# Altium schematic sheet PIC32MZ_cam_sch.SchDoc
size A3
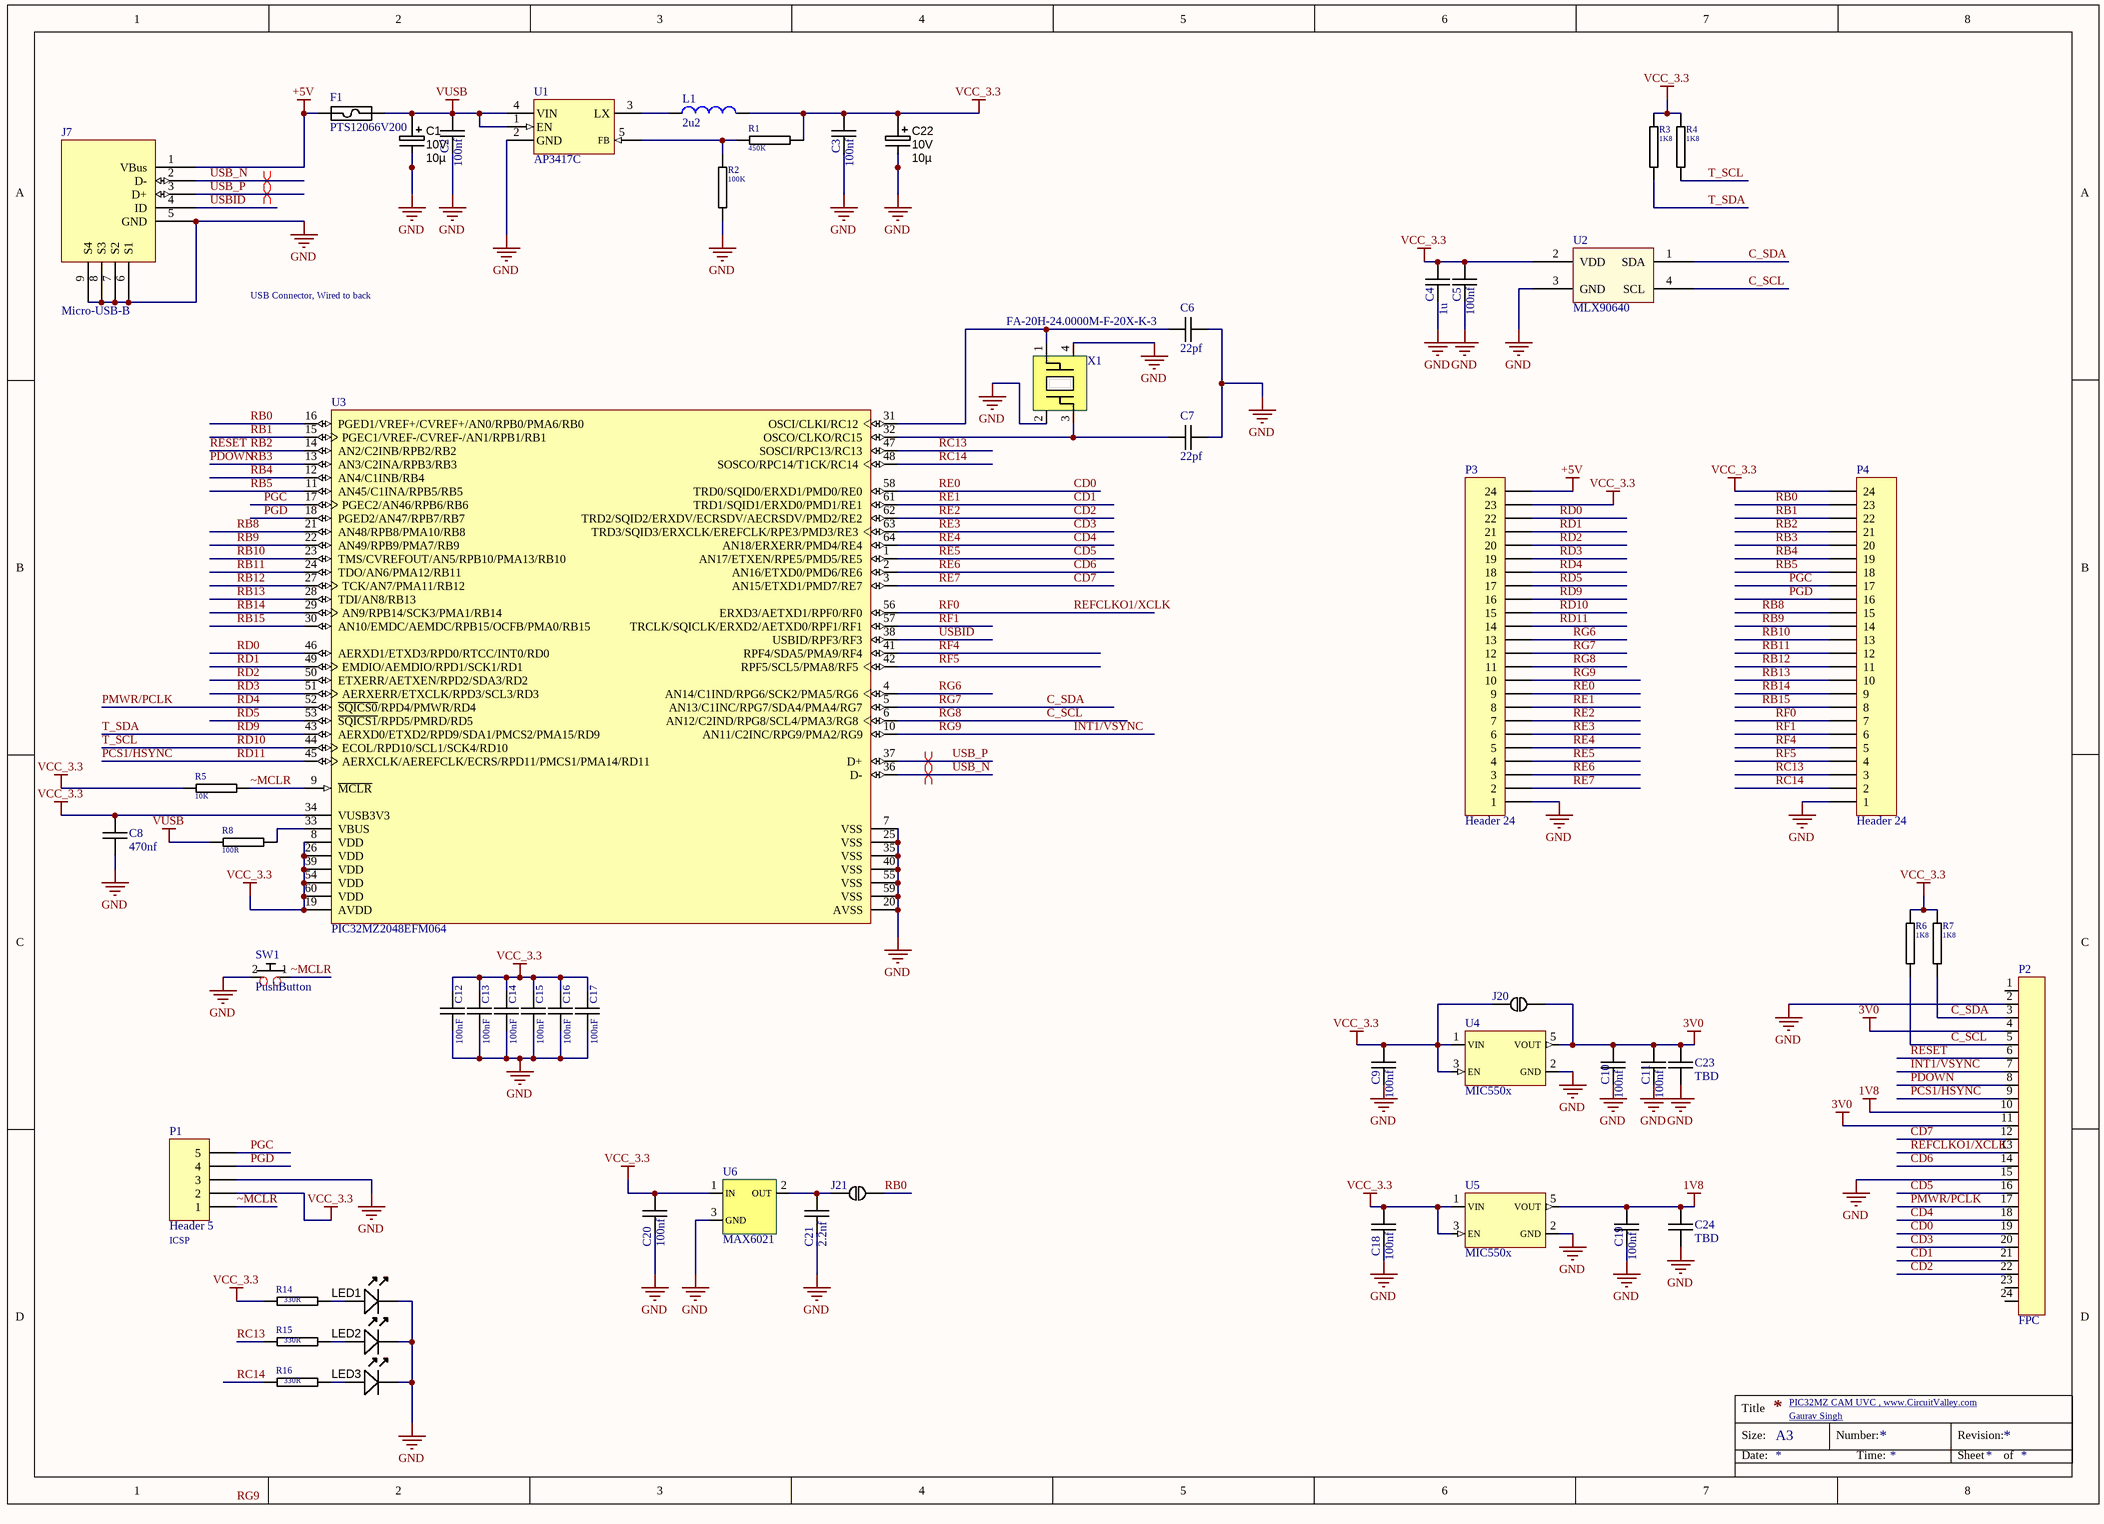
[diagram p0: PIC32MZ_cam_sch.SchDoc]

## Parts
C1  Ratings: 10V  [CAPMP3528X210N]  (hidden comment: 10µ)
C2  100nf  [0603C-GENERIC]
C3  100nf  [0603C-GENERIC]
C4  1u  [0603C-GENERIC]
C5  100nf  [0603C-GENERIC]
C6  22pf  [0603C-GENERIC]
C7  22pf  [0603C-GENERIC]
C8  470nf  [0603C-GENERIC]
C9  100nf  [0603C-GENERIC]
C10  100nf  [0603C-GENERIC]
C11  100nf  [0603C-GENERIC]
C12  100nF  [0603C-GENERIC]
C13  100nF  [0603C-GENERIC]
C14  100nF  [0603C-GENERIC]
C15  100nF  [0603C-GENERIC]
C16  100nF  [0603C-GENERIC]
C17  100nF  [0603C-GENERIC]
C18  100nf  [0603C-GENERIC]
C19  100nf  [0603C-GENERIC]
C20  100nf  [0603C-GENERIC]
C21  2.2nf  [0603C-GENERIC]
C22  Ratings: 10V  [CAPMP3528X210N]  (hidden comment: 10µ)
C23  TBD  [0805C-TBD]
C24  TBD  [0805C-TBD]
F1  PTS12066V200  [RESC3216N]
J7  Micro-USB-B  [10118193-0001lfc]
J20  BYPASS-MINI  [BYPASS-MINI]  (value not drawn)
J21  BYPASS-MINI  [BYPASS-MINI]  (value not drawn)
L1  2u2  [TAIYO_NRS4018T2R2MDGJ]
LED1  Blue  [LED-0805-K]  (value not drawn)
LED2  Blue  [LED-0805-K]  (value not drawn)
LED3  Blue  [LED-0805-K]  (value not drawn)
P1  Header 5  [HDR1X5]
P2  FPC  [OV7xxx Cam]
P3  Header 24  [HDR1X24]
P4  Header 24  [HDR1X24]
R1  450K  [0603R-10K]
R2  100K  [0603R-10K]
R3  1K8  [0603R-10K]
R4  1K8  [0603R-10K]
R5  10K  [0603R-10K]
R6  1K8  [0603R-10K]
R7  1K8  [0603R-10K]
R8  100R  [0603R-10K]
R14  330R  [0603R-10K]
R15  330R  [0603R-10K]
R16  330R  [0603R-10K]
SW1  PushButton  [PushButtonGrid5.08x3.81]
U1  AP3417C  [SOT23-5]
U2  MLX90640  [MLX90640]
U3  PIC32MZ2048EFM064  [MCHP-QFP-PT64_V]
U4  MIC550x  [SOT23-5]
U5  MIC550x  [SOT23-5]
U6  MAX6021  [SOT23-3]
X1  FA-20H-24.0000M-F-20X-K-3  [Active Oscillator 2520]

## Nets
1V8: C19.2 C24.1 P2.10 U5.5(VOUT)
3V0: C10.2 C11.2 C23.1 J20.1 P2.4 P2.11 U4.5(VOUT)
+5V: F1.1 J7.1(VBus) P3.24
GND: C1.2 C2.1 C3.1 C4.1 C5.1 C6.1 C7.1 C8.2 C9.1 C10.1 C11.1 C12.1 C13.1 C14.1 C15.1 C16.1 C17.1 C18.1 C19.1 C20.1 C21.1 C22.2 C23.2 C24.2 J7.5(GND) J7.6(S1) J7.7(S2) J7.8(S3) J7.9(S4) LED1.K LED2.K LED3.K P1.3 P2.2 P2.15 P3.1 P4.1 R2.1 SW1.2(P2) U1.2(GND) U2.3(GND) U3.7(VSS) U3.20(AVSS) U3.25(VSS) U3.35(VSS) U3.40(VSS) U3.55(VSS) U3.59(VSS) U4.2(GND) U5.2(GND) U6.3(GND) X1.2 X1.4
VCC_3.3: C3.2 C4.2 C5.2 C8.1 C9.2 C12.2 C13.2 C14.2 C15.2 C16.2 C17.2 C18.2 C20.2 C22.1 J20.2 L1.2 P1.2 P3.23 P4.24 R1.2 R3.2 R4.2 R5.1 R6.2 R7.2 R14.1 U2.2(VDD) U3.8(VDD) U3.19(AVDD) U3.26(VDD) U3.34(VUSB3V3) U3.39(VDD) U3.54(VDD) U3.60(VDD) U4.1(VIN) U4.3(EN) U5.1(VIN) U5.3(EN) U6.1(IN)
VUSB: C1.1 C2.2 F1.2 R8.1 U1.1(EN) U1.4(VIN)
C_SCL: P2.5 P3.11 R6.1 U2.4(SCL) U3.6(AN12/C2IND/RPG8/SCL4/PMA3/RG8)  [also labelled RG8]
C_SDA: P2.3 P3.12 R7.1 U2.1(SDA) U3.5(AN13/C1INC/RPG7/SDA4/PMA4/RG7)  [also labelled RG7]
CD0: P2.19 P3.9 U3.58(TRD0/SQID0/ERXD1/PMD0/RE0)  [also labelled RE0]
CD1: P2.21 P3.8 U3.61(TRD1/SQID1/ERXD0/PMD1/RE1)  [also labelled RE1]
CD2: P2.22 P3.7 U3.62(TRD2/SQID2/ERXDV/ECRSDV/AECRSDV/PMD2/RE2)  [also labelled RE2]
CD3: P2.20 P3.6 U3.63(TRD3/SQID3/ERXCLK/EREFCLK/RPE3/PMD3/RE3)  [also labelled RE3]
CD4: P2.18 P3.5 U3.64(AN18/ERXERR/PMD4/RE4)  [also labelled RE4]
CD5: P2.16 P3.4 U3.1(AN17/ETXEN/RPE5/PMD5/RE5)  [also labelled RE5]
CD6: P2.14 P3.3 U3.2(AN16/ETXD0/PMD6/RE6)  [also labelled RE6]
CD7: P2.12 P3.2 U3.3(AN15/ETXD1/PMD7/RE7)  [also labelled RE7]
INT1/VSYNC: P2.7 P3.10 U3.10(AN11/C2INC/RPG9/PMA2/RG9)  [also labelled RG9]
PCS1/HSYNC: P2.9 P3.14 U3.45(AERXCLK/AEREFCLK/ECRS/RPD11/PMCS1/PMA14/RD11)  [also labelled RD11]
PDOWN: P2.8 P4.20 U3.13(AN3/C2INA/RPB3/RB3)  [also labelled RB3]
PGC: P1.5 P4.17 U3.17(PGEC2/AN46/RPB6/RB6)
PGD: P1.4 P4.16 U3.18(PGED2/AN47/RPB7/RB7)
PMWR/PCLK: P2.17 P3.18 U3.52(~{SQICS0}/RPD4/PMWR/RD4)  [also labelled RD4]
RB0: J21.1 P4.23 U3.16(PGED1/VREF+/CVREF+/AN0/RPB0/PMA6/RB0)
RB1: P4.22 U3.15(PGEC1/VREF-/CVREF-/AN1/RPB1/RB1)
RB2: P2.6 P4.21 U3.14(AN2/C2INB/RPB2/RB2)  [also labelled RESET]
RB4: P4.19 U3.12(AN4/C1INB/RB4)
RB5: P4.18 U3.11(AN45/C1INA/RPB5/RB5)
RB8: P4.15 U3.21(AN48/RPB8/PMA10/RB8)
RB9: P4.14 U3.22(AN49/RPB9/PMA7/RB9)
RB10: P4.13 U3.23(TMS/CVREFOUT/AN5/RPB10/PMA13/RB10)
RB11: P4.12 U3.24(TDO/AN6/PMA12/RB11)
RB12: P4.11 U3.27(TCK/AN7/PMA11/RB12)
RB13: P4.10 U3.28(TDI/AN8/RB13)
RB14: P4.9 U3.29(AN9/RPB14/SCK3/PMA1/RB14)
RB15: P4.8 U3.30(AN10/EMDC/AEMDC/RPB15/OCFB/PMA0/RB15)
RC13: P4.3 R15.1 U3.47(SOSCI/RPC13/RC13)
RC14: P4.2 R16.1 U3.48(SOSCO/RPC14/T1CK/RC14)
RD0: P3.22 U3.46(AERXD1/ETXD3/RPD0/RTCC/INT0/RD0)
RD1: P3.21 U3.49(EMDIO/AEMDIO/RPD1/SCK1/RD1)
RD2: P3.20 U3.50(ETXERR/AETXEN/RPD2/SDA3/RD2)
RD3: P3.19 U3.51(AERXERR/ETXCLK/RPD3/SCL3/RD3)
RD5: P3.17 U3.53(~{SQICS1}/RPD5/PMRD/RD5)
RD9: P3.16 R3.1 U3.43(AERXD0/ETXD2/RPD9/SDA1/PMCS2/PMA15/RD9)  [also labelled T_SDA]
RD10: P3.15 R4.1 U3.44(ECOL/RPD10/SCL1/SCK4/RD10)  [also labelled T_SCL]
REFCLKO1/XCLK: P2.13 P4.7 U3.56(ERXD3/AETXD1/RPF0/RF0)  [also labelled RF0]
RF1: P4.6 U3.57(TRCLK/SQICLK/ERXD2/AETXD0/RPF1/RF1)
RF4: P4.5 U3.41(RPF4/SDA5/PMA9/RF4)
RF5: P4.4 U3.42(RPF5/SCL5/PMA8/RF5)
RG6: P3.13 U3.4(AN14/C1IND/RPG6/SCK2/PMA5/RG6)
USB_N: J7.2(D-) U3.36(D-)
USB_P: J7.3(D+) U3.37(D+)
USBID: J7.4(ID) U3.38(USBID/RPF3/RF3)
~MCLR: P1.1 R5.2 SW1.1(P1) U3.9(~{MCLR})
NetC6_2: C6.2 U3.31(OSCI/CLKI/RC12) X1.1
NetC7_2: C7.2 U3.32(OSCO/CLKO/RC15) X1.3
NetC21_2: C21.2 J21.2 U6.2(OUT)
NetL1_1: L1.1 U1.3(LX)
NetLED1_A: LED1.A R14.2
NetLED2_A: LED2.A R15.2
NetLED3_A: LED3.A R16.2
NetR1_1: R1.1 R2.2 U1.5(FB)
NetR8_2: R8.2 U3.33(VBUS)

Not connected (* = marked no-connect by the designer): P2 1 23 24

## Layout directives
differential pair: USB_N, USB_P

## Notes on the sheet
- USB Connector, Wired to back
- (near P1) ICSP
- PIC32MZ CAM UVC , www.CircuitValley.com
- Gaurav Singh
- Labels drawn without touching a wire or pin: RG9
- Title
- Size:
- Date:
- A3
- Number:
- Time:
- Revision:
- Sheet
- of

## Library data of the parts
C1 C22 = CAPT_47u_1210_6V3: Capacitor SMD Tantalum 47uF 20% 6.3V 1210; Manufacturer 1: AVX Corporation; Manufacturer Part Number 1: TCJB476M006R0070; Manufacturer Size Code: B; Voltage - Rated: 6V3; ESR (Equivalent Series Resistance): 70.0 mOhm; Type: Molded; Package / Case: 1210 (3528 Metric); Tolerance: ±20%; Material: Tantalum; Supplier 1: Digi-Key; Supplier Part Number 1: 478-3139-1-ND; Operating Temperature: -55°C ~ 125°C; Size / Dimension: 0.138" L x 0.110" W (3.50mm x 2.80mm); Height - Seated (Max): 0.083" (2.10mm); ComponentLink1URL: http://www.avx.com/docs/Catalogs/tcj.pdf; ComponentLink1Description: http://www.avx.com/docs/Catalogs/tcj.pdf; Value: 10µ
C2-C11 C18-C21 = 0603C-10UF-6V3-X5R-MUR: CAPACITOR 0603 CERAMIC; Manufacturer: Murata Electronics North America; Manufacturer Part Number: GRM188R60J106ME47D; Reel: C24; Supplier 1: Digi-Key; Supplier Part Number 1: 490-3896-2-ND
C12-C17 = 0603C-100NF-25V-X7R-TDK: CAPACITOR 0603 CERAMIC; Manufacturer Part Number: C1608X7R1E104K; Manufacturer: TDK Corporation; Reel: C12; Supplier 1: Digi-Key; Supplier Part Number 1: 445-1316-2-ND
C23 C24 = 0805C-TBD: CAPACITOR 0805 CERAMIC VALUE TO BE DETERMINED
F1 = FUSE-GENERIC: GENERIC FUSE
J20 J21 = BYPASS-MINI: SOLDERDOT BYPASS; Manufacturer Part Number 1: Board Feature; Reel: Open; Supplier 1: Solder-it-yourself; Manufacturer 1: Board feature
L1 = inductor_smd: PartNumber: NRS4018T2R2MDGJ
LED1-LED3 = LED_SMD_Blue_0805_100mcd: LED 0805 SMD Blue 100mcd 470nm; Manufacturer 1: Ligitek; Manufacturer Part Number 1: LG-170DBKZ-CT; Material: InGaN/GaN; Ratings: 100 mcd; 470 nm; Package / Case: 0805; Value: Blue; Color: Blue
P1 = Header 5: Header, 5-Pin; LatestRevisionDate: 17-Jul-2002; LatestRevisionNote: Re-released for DXP Platform.; Publisher: Altium Limited
P2 = FPC24_PIN
P3 P4 = Header 24: Header, 24-Pin; LatestRevisionDate: 17-Jul-2002; LatestRevisionNote: Re-released for DXP Platform.; Publisher: Altium Limited
R1-R8 R14-R16 = 0603R-10K: GENERIC RESISTOR 0603; Manufacturer: Stackpole Electronics Inc; Manufacturer Part Number: RMCF 1/16 10K 1% R; Tolerance: ±1%; Power (Watts): 0.1W, 1/10W; Temperature Coefficient: ±100ppm/°C; Resistance In Ohms: 10.0K; Reel: R21; Category: Resistors; Supplier Part Number: RMCF1/1610KFRDKR-ND; Lead Style: Surface Mount (SMD - SMT); RoHS: RoHS Compliant; Packaging: Digi-Reel®; Case: 0603 (1608 metric); Composition: Thick Film; Supplier: Digi-Key; Supplier 1: Digi-Key; Supplier Part Number 1: RMCF0603FT10K0DKR-ND
U6 = MAX6021_Ref
X1 = Crstal_passive_2520
J7 = Micro-USB-B: Mouser: https://www.mouser.de/Search/ProductDetail.aspx?R=10118193-0001LFvirtualkey64910000virtualkey649-10118193-0001LF; Part: 10118193-0001lfc